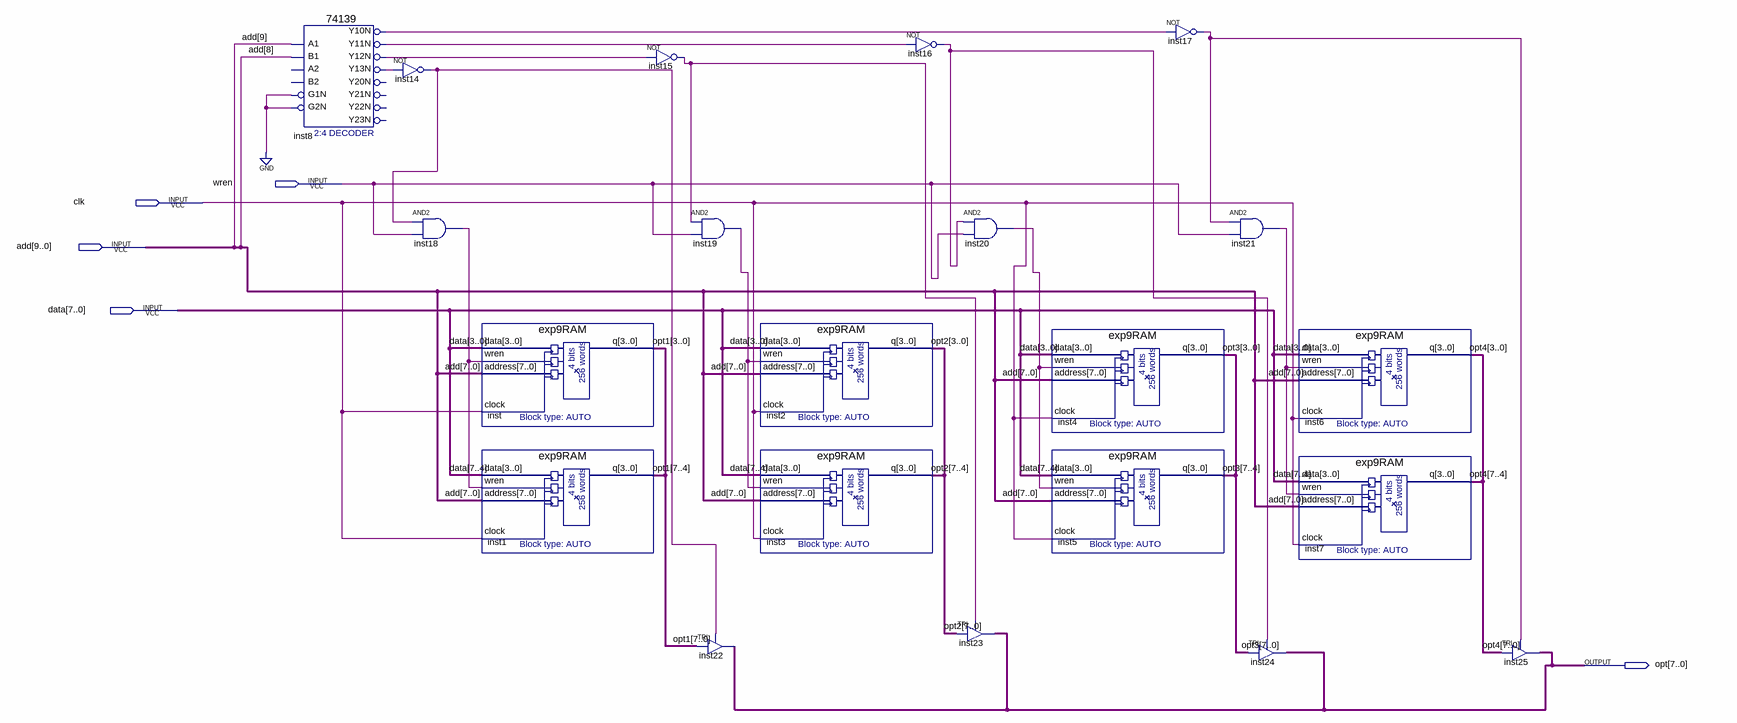
[diagram p0: schematic sheet]
// Quartus schematic exp9.bdf as structural Verilog: 21 symbols, 5 pins
module exp9 (
  input  wren,
  input  clk,
  input  [9:0] add,
  input  [7:0] data,
  output [7:0] opt
);

  wire inst8_y10n, inst8_y11n, inst8_y12n, inst8_y13n, inst14_out, inst15_out, inst16_out, inst17_out,
       inst18_out, inst19_out, inst20_out, inst21_out;
  wire [7:0] opt1, opt2, opt3, opt4;

  \74139  inst8 (
    .A1(add[9]), .B1(add[8]), .G1N(1'b0), .G2N(1'b0), .Y10N(inst8_y10n), .Y13N(inst8_y13n),
    .Y12N(inst8_y12n), .Y11N(inst8_y11n));  // open: A2, B2, Y20N, Y21N, Y22N, Y23N
  not inst14 (inst14_out, inst8_y13n);
  and inst18 (inst18_out, inst14_out, wren);
  exp9RAM inst (.data(data[3:0]), .wren(inst18_out), .address(add[7:0]), .clock(clk), .q(opt1[3:0]));
  exp9RAM inst1 (.data(data[7:4]), .wren(inst18_out), .address(add[7:0]), .clock(clk), .q(opt1[7:4]));
  not inst15 (inst15_out, inst8_y12n);
  and inst19 (inst19_out, inst15_out, wren);
  TRI inst22[7:0] (.IN(opt1), .OE(inst14_out), .OUT(opt));
  exp9RAM inst2 (.data(data[3:0]), .wren(inst19_out), .address(add[7:0]), .clock(clk), .q(opt2[3:0]));
  exp9RAM inst3 (.data(data[7:4]), .wren(inst19_out), .address(add[7:0]), .clock(clk), .q(opt2[7:4]));
  not inst16 (inst16_out, inst8_y11n);
  and inst20 (inst20_out, inst16_out, wren);
  TRI inst23[7:0] (.IN(opt2), .OE(inst15_out), .OUT(opt));
  exp9RAM inst4 (.data(data[3:0]), .wren(inst20_out), .address(add[7:0]), .clock(clk), .q(opt3[3:0]));
  exp9RAM inst5 (.data(data[7:4]), .wren(inst20_out), .address(add[7:0]), .clock(clk), .q(opt3[7:4]));
  not inst17 (inst17_out, inst8_y10n);
  and inst21 (inst21_out, inst17_out, wren);
  TRI inst24[7:0] (.IN(opt3), .OE(inst16_out), .OUT(opt));
  exp9RAM inst6 (.data(data[3:0]), .wren(inst21_out), .address(add[7:0]), .clock(clk), .q(opt4[3:0]));
  exp9RAM inst7 (.data(data[7:4]), .wren(inst21_out), .address(add[7:0]), .clock(clk), .q(opt4[7:4]));
  TRI inst25[7:0] (.IN(opt4), .OE(inst17_out), .OUT(opt));
endmodule
